# EAGLE design Justin Ngo_u0453732_MotorPCB_Rev3 (EAGLE 7.7.0)
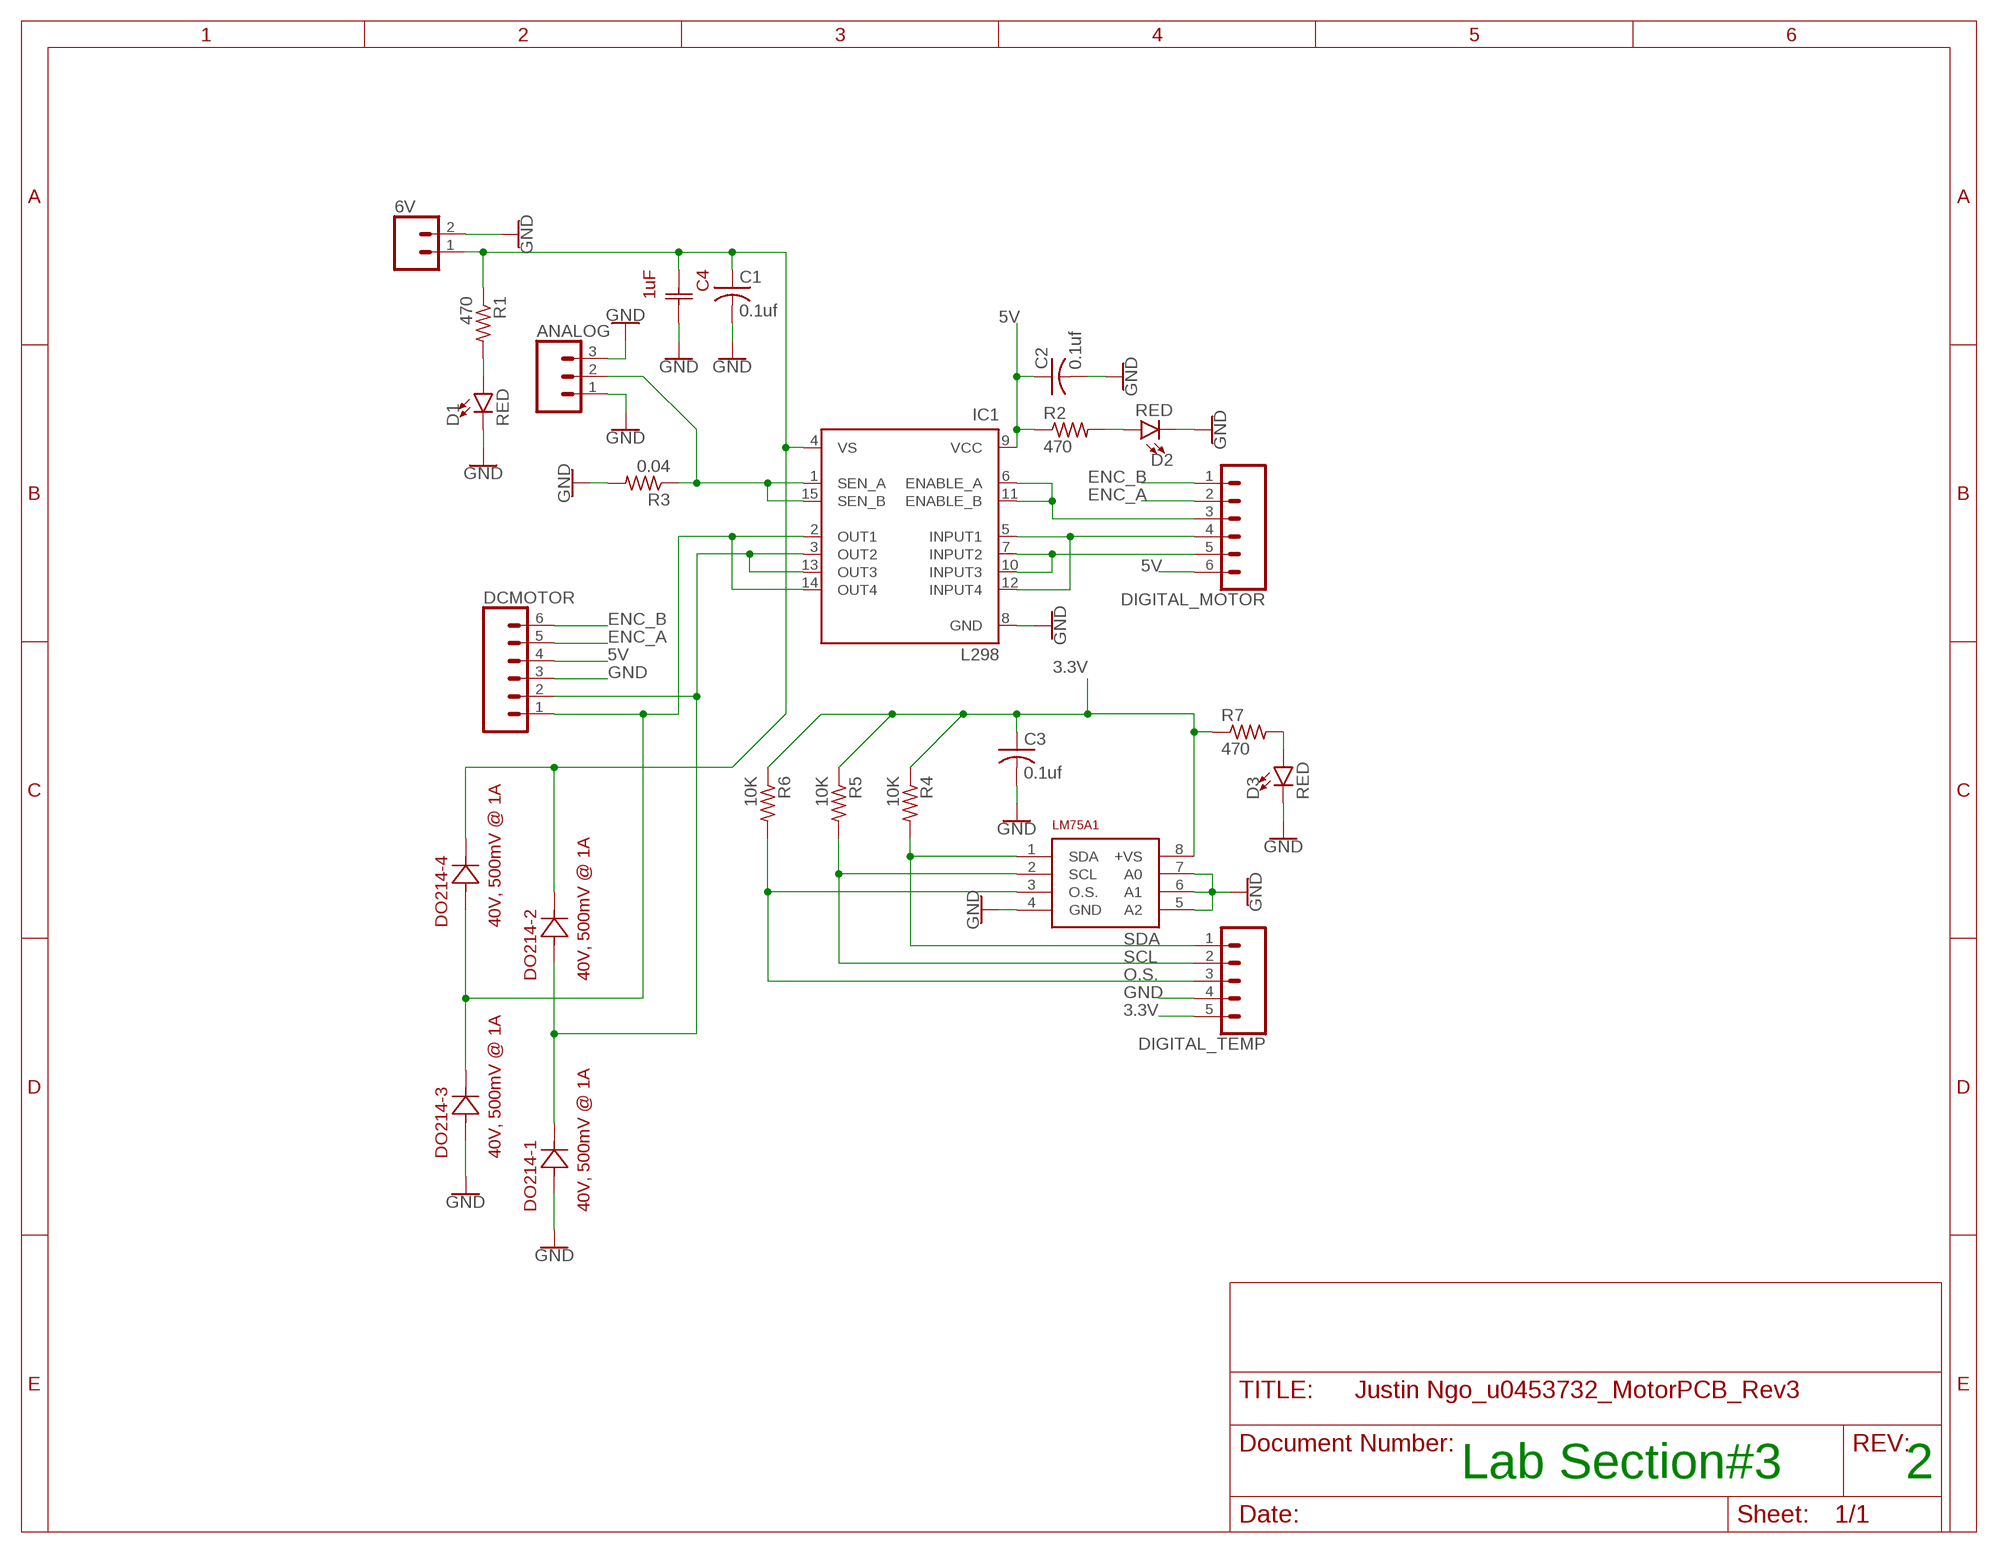
[diagram p0: schematic, sheet 1]

## Parts
6V  CONN_025MM  [SCREWTERMINAL-5MM-2]
ANALOG  CONN_03  [1X03]
C1  0.1uf  C-USC1206  [C1206]
C2  0.1uf  C-USC1206  [C1206]
C3  0.1uf  C-USC1206  [C1206]
C4  1uF  UVK1H010MDD1TD  [U1-E]
D1  RED  LED-RED1206  [LED-1206]
D2  RED  LED-RED1206  [LED-1206]
D3  RED  LED-RED1206  [LED-1206]
DCMOTOR  CONN_06LOCK_LONGPADS  [1X06_LOCK_LONGPADS]
DIGITAL_MOTOR  CONN_06LOCK_LONGPADS  [1X06_LOCK_LONGPADS]
DIGITAL_TEMP  CONN_05LOCK_LONGPADS  [1X05_LOCK_LONGPADS]
DO214-1  40V, 500mV @ 1A  SS14  [DIODE_DO214AC]
DO214-2  40V, 500mV @ 1A  SS14  [DIODE_DO214AC]
DO214-3  40V, 500mV @ 1A  SS14  [DIODE_DO214AC]
DO214-4  40V, 500mV @ 1A  SS14  [DIODE_DO214AC]
IC1  L298  [MULTIWATT-15]
LM75A1  TI-LM75A  [TI-LM75A]
R1  470  R-US_R1206  [R1206]
R2  470  R-US_R1206  [R1206]
R3  0.04  R-US_R1206  [R1206]
R4  10K  R-US_R1206  [R1206]
R5  10K  R-US_R1206  [R1206]
R6  10K  R-US_R1206  [R1206]
R7  470  R-US_R1206  [R1206]

## Nets
3.3V: C3.1 DIGITAL_TEMP.5 LM75A1.8(+VS) R4.1 R5.1 R6.1 R7.1
5V: C2.1 DCMOTOR.4 DIGITAL_MOTOR.6 IC1.9(VCC) R2.1
ANALOG: ANALOG.2 IC1.1(SEN_A) IC1.15(SEN_B) R3.1
ENC_A: DCMOTOR.5 DIGITAL_MOTOR.2
ENC_B: DCMOTOR.6 DIGITAL_MOTOR.1
GND: 6V.2 ANALOG.1 ANALOG.3 C1.2 C2.2 C3.2 C4.2 D1.C D2.C D3.C DCMOTOR.3 DIGITAL_TEMP.4 DO214-1.2 DO214-3.2 IC1.8(GND) LM75A1.4(GND) LM75A1.5(A2) LM75A1.6(A1) LM75A1.7(A0) R3.2
N$1: D1.A R1.2
N$2: D3.A R7.2
N$4: DIGITAL_MOTOR.3 IC1.6(ENABLE_A) IC1.11(ENABLE_B)
N$6: DIGITAL_MOTOR.5 IC1.7(INPUT2) IC1.10(INPUT3)
N$9: DIGITAL_MOTOR.4 IC1.5(INPUT1) IC1.12(INPUT4)
N$10: DCMOTOR.2 DO214-1.1 DO214-2.2 IC1.3(OUT2) IC1.13(OUT3)
N$12: DCMOTOR.1 DO214-3.1 DO214-4.2 IC1.2(OUT1) IC1.14(OUT4)
N$13: 6V.1 C1.1 C4.1 DO214-2.1 DO214-4.1 IC1.4(VS) R1.1
N$15: D2.A R2.2
O.S.: DIGITAL_TEMP.3 LM75A1.3(O.S.) R6.2
SCL: DIGITAL_TEMP.2 LM75A1.2(SCL) R5.2
SDA: DIGITAL_TEMP.1 LM75A1.1(SDA) R4.2

## Notes on the sheet
- Lab Section#3 | 2

## Library data of the parts
6V = SparkFun-Connectors:CONN_02: Multi connection point. Often used as Generic Header-pin footprint for 0.1 inch spaced/style header connections On any of the 0.1 inch spaced packages, you can populate with these: Break Away Headers - Straight <https://www.sparkfun.com/products/116> (PRT-00116) Break Away Male Headers - Right Angle <https://www.sparkfun.com/products/553> (PRT-00553) Female Headers <https://www.sparkfun.com/products/115> (PRT-00115) Break Away Headers - Machine Pin <https://www.sparkfun.com/products/117> (PRT-00117) Break Away Female Headers - Swiss Machine Pin <https://www.sparkfun.com/products/743> (PRT-00743) For SCREWTERMINALS and SPRING TERMINALS visit here: Screw Terimnals on SparkFun.com <https://www.sparkfun.com/search/results?term=Screw+Terminals> (5mm/3.5mm/2.54mm spacing) This device is also useful as a general connection point to wire up your design to another part of your project. Our various solder wires solder well into these plated through hole pads. Hook-Up Wire - Assortment (Stranded, 22 AWG) <https://www.sparkfun.com/products/11375> (PRT-11375) Hook-Up Wire - Assortment (Solid Core, 22 AWG) <https://www.sparkfun.com/products/11367> (PRT-11367) View the entire wire category on our website here <https://www.sparkfun.com/categories/141> Special notes: Molex polarized connector foot print use with: PRT-08233 with associated crimp pins and housings. 2.54_SCREWTERM for use with PRT-10571. 3.5mm Screw Terminal footprints for PRT-08084 5mm Screw Terminal footprints for use with PRT-08432; SF_SKU: PRT-08432
ANALOG = SparkFun-Connectors:CONN_03: Multi connection point. Often used as Generic Header-pin footprint for 0.1 inch spaced/style header connections On any of the 0.1 inch spaced packages, you can populate with these: Break Away Headers - Straight <https://www.sparkfun.com/products/116> (PRT-00116) Break Away Male Headers - Right Angle <https://www.sparkfun.com/products/553> (PRT-00553) Female Headers <https://www.sparkfun.com/products/115> (PRT-00115) Break Away Headers - Machine Pin <https://www.sparkfun.com/products/117> (PRT-00117) Break Away Female Headers - Swiss Machine Pin <https://www.sparkfun.com/products/743> (PRT-00743) Stackable Header - 3 Pin (Female, 0.1") <https://www.sparkfun.com/products/13875> (PRT-13875) For SCREWTERMINALS and SPRING TERMINALS visit here: Screw Terimnals on SparkFun.com <https://www.sparkfun.com/search/results?term=Screw+Terminals> (5mm/3.5mm/2.54mm spacing) This device is also useful as a general connection point to wire up your design to another part of your project. Our various solder wires solder well into these plated through hole pads. Hook-Up Wire - Assortment (Stranded, 22 AWG) <https://www.sparkfun.com/products/11375> (PRT-11375) Hook-Up Wire - Assortment (Solid Core, 22 AWG) <https://www.sparkfun.com/products/11367> (PRT-11367) View the entire wire category on our website here <https://www.sparkfun.com/categories/141> Special notes: Molex polarized connector foot print use with SKU : PRT-08232 with associated crimp pins and housings.
C1-C3 = rcl:C-US: CAPACITOR, American symbol
C4 = Ngo3:UVK1H010MDD1TD; COPYRIGHT: Copyright C 2015 Accelerated Designs. All rights reserved; MANUFACTURER_PART_NUMBER: UVK1H010MDD1TD; VENDOR: Vendor
D1-D3 = SparkFun-LED:LED-RED: Red SMD LED Used in manufacturing of most products at SparkFun Packages: 0603 - SMD 0603 package [Product Link] <http://docs.avagotech.com/docs/AV02-0551EN> 0603 SMART - SMD 0603 SMART package ( more efficient and expensive)[Product Link] <http://www.osram-os.com/Graphics/XPic2/00077099_0.pdf> 1206 - SMD1206 package [Product Link] <https://www.sparkfun.com/datasheets/DevTools/LilyPad/Q150OVS4.pdff> SparkFun Products: Pro Mini 328 -5V <https://www.sparkfun.com/products/821> RedBoard <https://www.sparkfun.com/products/12757> IOIO-OTG <https://www.sparkfun.com/products/13613>; PROD_ID: DIO-09912
DCMOTOR DIGITAL_MOTOR = SparkFun-Connectors:CONN_06: Multi connection point. Often used as Generic Header-pin footprint for 0.1 inch spaced/style header connections On any of the 0.1 inch spaced packages, you can populate with these: Break Away Headers - Straight <https://www.sparkfun.com/products/116> (PRT-00116) Break Away Male Headers - Right Angle <https://www.sparkfun.com/products/553> (PRT-00553) Female Headers <https://www.sparkfun.com/products/115> (PRT-00115) Break Away Headers - Machine Pin <https://www.sparkfun.com/products/117> (PRT-00117) Break Away Female Headers - Swiss Machine Pin <https://www.sparkfun.com/products/743> (PRT-00743) Arduino Stackable Header - 6 Pin <https://www.sparkfun.com/products/9280> (PRT-09280) For SCREWTERMINALS and SPRING TERMINALS visit here: Screw Terimnals on SparkFun.com <https://www.sparkfun.com/search/results?term=Screw+Terminals> (5mm/3.5mm/2.54mm spacing) This device is also useful as a general connection point to wire up your design to another part of your project. Our various solder wires solder well into these plated through hole pads. Hook-Up Wire - Assortment (Stranded, 22 AWG) <https://www.sparkfun.com/products/11375> (PRT-11375) Hook-Up Wire - Assortment (Solid Core, 22 AWG) <https://www.sparkfun.com/products/11367> (PRT-11367) View the entire wire category on our website here <https://www.sparkfun.com/categories/141>
DIGITAL_TEMP = SparkFun-Connectors:CONN_05: Multi connection point. Often used as Generic Header-pin footprint for 0.1 inch spaced/style header connections On any of the 0.1 inch spaced packages, you can populate with these: Break Away Headers - Straight <https://www.sparkfun.com/products/116> (PRT-00116) Break Away Male Headers - Right Angle <https://www.sparkfun.com/products/553> (PRT-00553) Female Headers <https://www.sparkfun.com/products/115> (PRT-00115) Break Away Headers - Machine Pin <https://www.sparkfun.com/products/117> (PRT-00117) Break Away Female Headers - Swiss Machine Pin <https://www.sparkfun.com/products/743> (PRT-00743) For SCREWTERMINALS and SPRING TERMINALS visit here: Screw Terimnals on SparkFun.com <https://www.sparkfun.com/search/results?term=Screw+Terminals> (5mm/3.5mm/2.54mm spacing) This device is also useful as a general connection point to wire up your design to another part of your project. Our various solder wires solder well into these plated through hole pads. Hook-Up Wire - Assortment (Stranded, 22 AWG) <https://www.sparkfun.com/products/11375> (PRT-11375) Hook-Up Wire - Assortment (Solid Core, 22 AWG) <https://www.sparkfun.com/products/11367> (PRT-11367) View the entire wire category on our website here <https://www.sparkfun.com/categories/141> Special notes: Molex polarized connector foot print use with SKU : PRT-08231 with associated crimp pins and housings. 1MM SMD Version SKU: PRT-10208
DO214-1-DO214-4 = Ngo2:SS14; COPYRIGHT: Copyright C 2015 Accelerated Designs. All rights reserved; DESCRIPTION: Schottky barrier diodeSS14 1A 40V; FAMILY: Rectifier; MANUFACTURER_NAME: Vishay; MANUFACTURER_PART_NUMBER: SS14; RSPARTNUMBER: 4470352; SECTION: Discretes; SUPERSECTION: Semiconductors; VENDOR: Vishay
IC1 = st-microelectronics:L298: DUAL FULL-BRIDGE DRIVER; MPN: L298N; OC_FARNELL: 1589425; OC_NEWARK: 32M1527
LM75A1 = Ngo:TI-LM75A
R1-R7 = rcl:R-US_: RESISTOR, American symbol

## Board
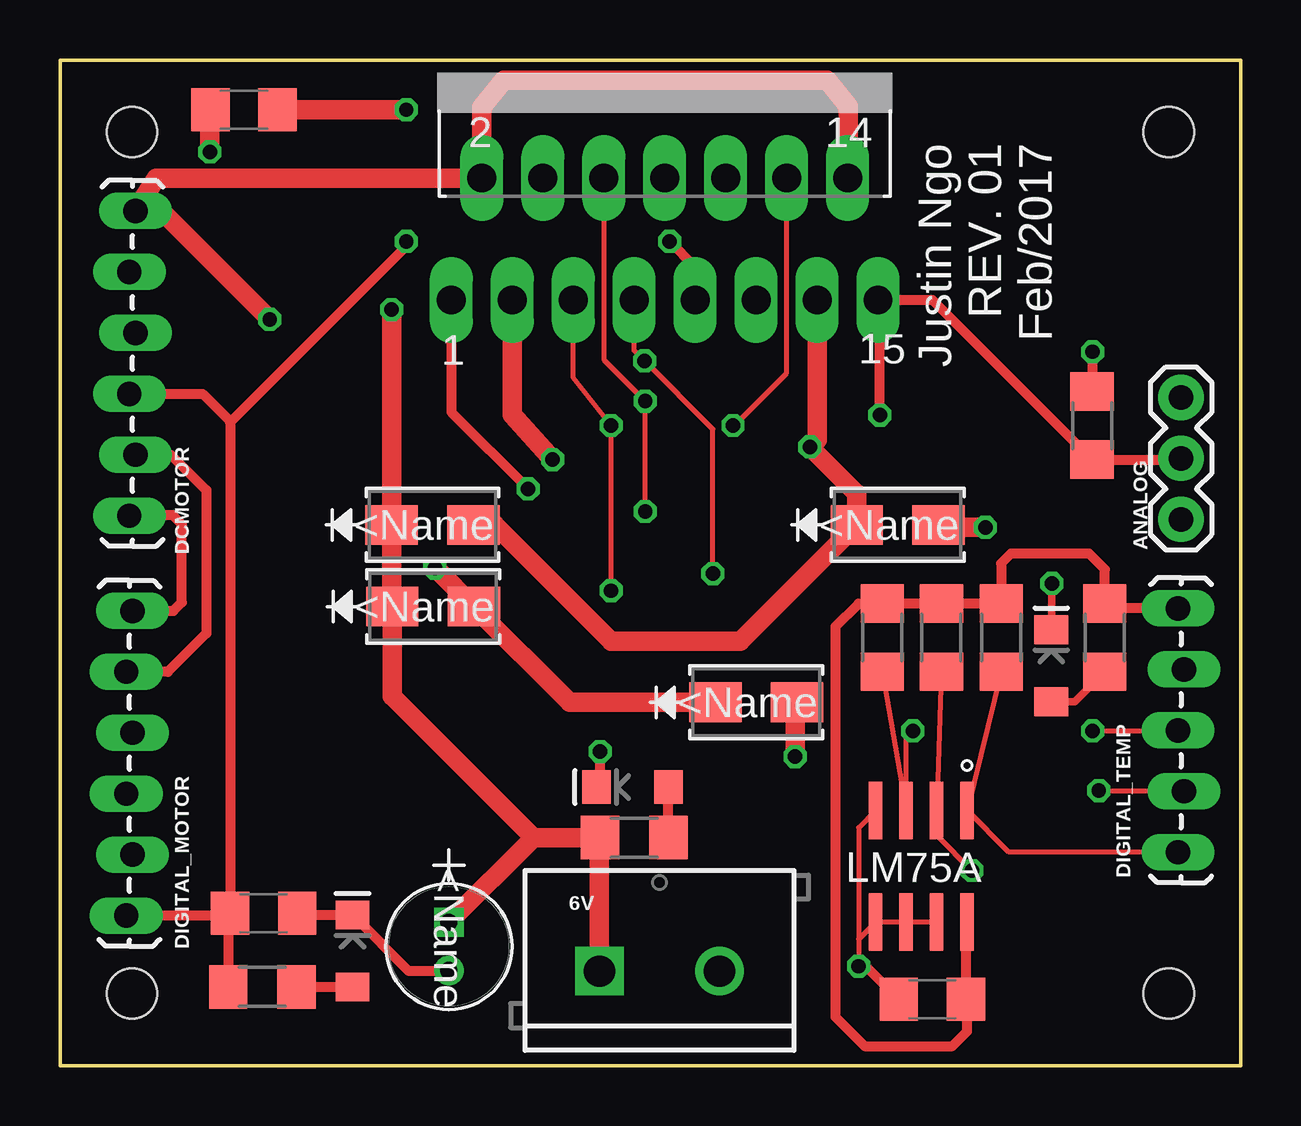
[diagram p1: board, top side]
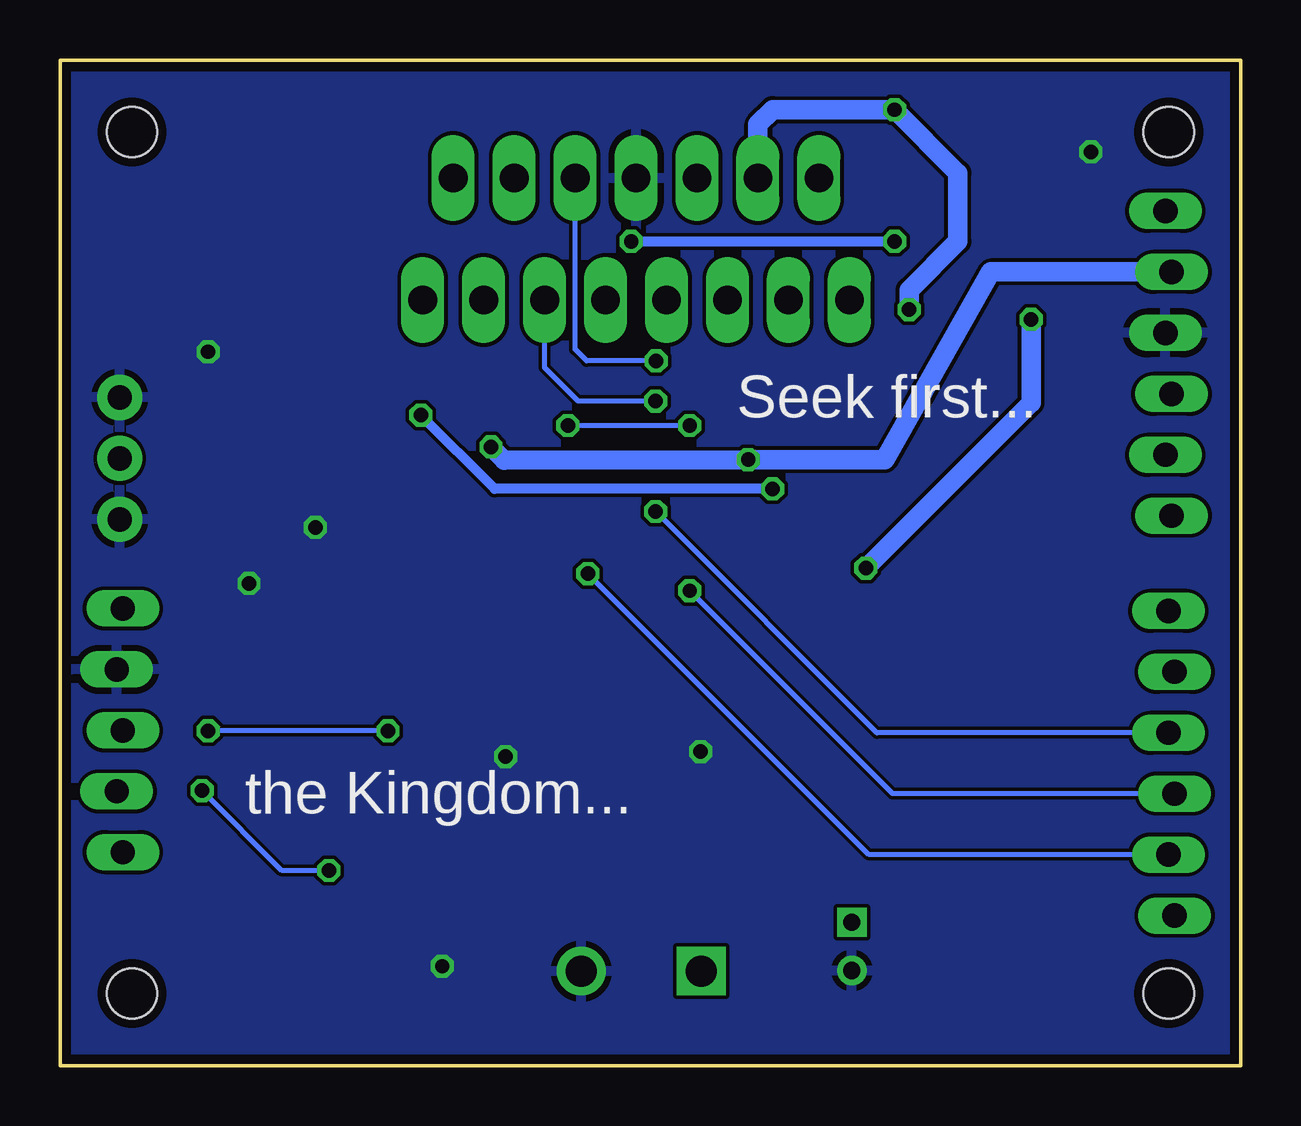
[diagram p2: board, bottom side, seen from below]

Size 49.2 x 41.9 mm. Coordinates in mm from the lower left corner, seen from the top.
Outline: 0,0 49.2,0 49.2,41.9 0,41.9 0,0
Copper layers (1*16): Top 0.0356mm / dielectric 1.5011mm / Bottom 0.0356mm
Design rules "oshpark-2layer": minimum track width 6mil, minimum drill 13mil, track to track 6mil, track to pad 6mil, pad to pad 6mil, via to via 6mil, smd to smd 6mil, copper to edge 15mil, drill to drill 6mil, minimum pad ring 7mil, minimum via ring 7mil, stop-mask expansion 2.5mil, vias tented up to drill 0mil, thermal gap 10mil
Holes 2.1 mm at 3,38.9 46.2,38.9 3,3 46.2,3

### Footprints (pad centres in the part's own frame; a part is rotated, then mirrored left to right if it is on the bottom)
SCREWTERMINAL-5MM-2 = drill 1.3 pad 2.032 square: 1 0,0 | drill 1.3 pad 2.032: 2 5,0
1X03 = drill 1.016 pad 1.88: 1 0,0; 2 2.54,0; 3 5.08,0
C1206 = smd 1.6 x 1.8: 1 -1.4,0; 2 1.4,0
U1-E = drill 0.711 pad 1.219 square: 1 -2.007,0 | drill 0.711 pad 1.219: 2 0,0
LED-1206 = smd 1.2 x 1.4: A -1.5,0; C 1.5,0
1X06_LOCK_LONGPADS = drill 1.016 long: 1 0,0; 2 2.54,-0.254; 3 5.08,0; 4 7.62,-0.254; 5 10.16,0; 6 12.7,-0.254
1X05_LOCK_LONGPADS = drill 1.016 long: 1 0,0; 2 2.54,-0.254; 3 5.08,0; 4 7.62,-0.254; 5 10.16,0
DIODE_DO214AC = smd 2.184 x 1.651: 1 -1.702,0; 2 1.702,0
MULTIWATT-15 = drill 1.2 long: 1 -8.89,-7.62; 2 -7.62,-2.54; 3 -6.35,-7.62; 4 -5.08,-2.54; 5 -3.81,-7.62; 6 -2.54,-2.54; 7 -1.27,-7.62; 8 0,-2.54; 9 1.27,-7.62; 10 2.54,-2.54; 11 3.81,-7.62; 12 5.08,-2.54; 13 6.35,-7.62; 14 7.62,-2.54; 15 8.89,-7.62
TI-LM75A = smd 0.559 x 2.388: 1 0,-2.324; 2 1.27,-2.324; 3 2.54,-2.324; 4 3.81,-2.324; 5 3.81,2.324; 6 2.54,2.324; 7 1.27,2.324; 8 0,2.324
R1206 = smd 1.6 x 1.803: 1 -1.422,0; 2 1.422,0

### Placement (x,y rotation side)
6V  22.48,3.94 0 top
ANALOG  46.71,22.76 90 top
C1  7.67,39.83 180 top
C2  8.48,6.35 0 top
C3  36.35,2.77 180 top
C4  16.21,3.96 270 top
D1  23.85,11.61 180 top
D2  12.19,4.78 90 top
D3  41.3,16.66 90 top
DCMOTOR  3.14,35.61 270 top
DIGITAL_MOTOR  3.01,18.95 270 top
DIGITAL_TEMP  46.58,8.89 90 top
DO214-1  34.9,22.53 0 top
DO214-2  15.52,22.53 0 top
DO214-3  29.01,15.14 0 top
DO214-4  15.54,19.13 0 top
IC1  25.2,39.52 0 top
LM75A1  37.8,8.31 180 top
R1  23.93,9.5 0 top
R2  8.43,3.28 0 top
R3  43,26.67 90 top
R4  39.22,17.83 270 top
R5  36.73,17.83 270 top
R6  34.26,17.83 270 top
R7  43.54,17.83 270 top

### Tracks (layer width: path | path; a pad name or v marks a point on that pad's centre or on a via)
3.3V
  Top 0.203: 37.8,2.82 C3.1
  Top 0.254: LM75A1.8 37.75,5.93
  Top 0.305: 37.8,2.72 C3.1
  Top 0.406: DIGITAL_TEMP.5 43.74,19.05 R7.1 43.54,20.68 42.88,21.34 39.62,21.34 39.22,20.93 R4.1 R5.1 R6.1 33.27,19.25 32.31,18.29 32.31,2.03 33.53,0.81 37.19,0.81 37.8,1.42 37.8,2.72 | 37.75,5.93 C3.1
5V  (via drill 0.6 pad 0.41)
  Top 0.305: 7.01,6.27 C2.1
  Top 0.406: DCMOTOR.4 5.94,27.99 7.11,26.82 | 7.11,26.82 7.08,26.79 C2.1 | R2.1 7.01,6.27 6.98,6.25 DIGITAL_MOTOR.6 | IC1.9 26.47,33.27 v25.4,34.34 | v14.43,34.34 14.43,34.14 7.11,26.82
  Bottom 0.406: v25.4,34.34 v14.43,34.34
ANALOG  (via drill 0.6 pad 0.41)
  Top 0.203: 46.66,25.25 ANALOG.2 | 34.14,31.85 IC1.15 34.16,31.83
  Top 0.406: IC1.15 36.35,31.9 R3.1 46.66,25.25 | IC1.1 16.31,27.23 v19.51,24.03 | v34.16,27.1 34.16,31.83
  Bottom 0.406: v19.51,24.03 31.09,24.03 v34.16,27.1
ENC_A
  Top 0.406: DCMOTOR.5 4.62,25.45 6.1,23.98 6.1,18.01 4.5,16.41 DIGITAL_MOTOR.2
ENC_B
  Top 0.406: DIGITAL_MOTOR.1 4.72,18.95 5.08,19.3 5.08,22.55 4.7,22.94 2.41,22.94 DCMOTOR.6
GND  (via drill 0.6 pad 0.41)
  Top 0.203: R3.2 43.03,28.12 | LM75A1.7 LM75A1.6 LM75A1.5 33.27,5.27 v33.27,4.14 33.27,9.92 LM75A1.4
  Top 0.254: D1.C 22.5,11.76
  Top 0.305: C2.2 9.96,6.28 | D3.C 41.33,18.19 v41.33,20.09
  Top 0.406: 22.5,11.76 v22.5,13.08 | 43.03,28.12 v43.03,29.74 | 9.96,6.28 D2.C 14.51,3.96 C4.2 | C3.2 33.58,4.14 v33.27,4.14
  Top 0.813: C1.2 6.25,39.8 v6.25,38.08 | DO214-3.2 30.63,15.06 v30.63,12.88 | DO214-1.2 36.7,22.43 v38.56,22.43
  pour Bottom: -1.63,43.28 51.61,43.28 52.02,43.28 52.02,-2.84 -1.63,-2.84
N$1
  Top 0.305: D1.A
  Top 0.406: R1.2 D1.A
N$2
  Top 0.305: R7.2 42.29,15.16 D3.A
N$4  (via drill 0.6 pad 0.41)
  Top 0.203: IC1.6 22.66,29.41 v24.38,27.69 v24.38,23.09
  Bottom 0.203: v24.38,27.69 27.61,27.69 29.01,29.08 IC1.11 | DIGITAL_MOTOR.3 15.16,13.87 v24.38,23.09
N$6  (via drill 0.6 pad 0.41)
  Top 0.203: IC1.7 23.93,29.79 v24.36,29.36 27.2,26.52 v27.2,20.5
  Bottom 0.203: v24.36,29.36 27.25,29.36 27.74,29.84 IC1.10 | DIGITAL_MOTOR.5 15.49,8.79 v27.2,20.5
N$9  (via drill 0.6 pad 0.41)
  Top 0.203: IC1.5 21.39,28.65 v22.96,26.67 v22.96,19.79 | v28.04,26.67 28.09,26.67 30.28,28.85 IC1.12
  Bottom 0.203: v22.96,26.67 v28.04,26.67 | DIGITAL_MOTOR.4 14.5,11.33 v22.96,19.79
N$10  (via drill 0.6 pad 0.41)
  Top 0.813: v20.52,25.25 18.85,27.13 IC1.3 | IC1.13 31.55,26.09 v31.24,25.78 33.2,23.82 DO214-1.1 28.35,17.68 22.96,17.68 18.11,22.53 DO214-2.2
  Bottom 0.813: v31.24,25.78 30.68,25.22 v20.52,25.25 14.83,25.25 10.41,33.07 DCMOTOR.2
N$12  (via drill 0.6 pad 0.41)
  Top 0.813: IC1.14 32.84,37.01 32.84,39.98 31.98,41.05 18.49,41.05 17.58,39.93 IC1.2 4.01,36.98 DCMOTOR.1 4.22,35.61 v8.74,31.09 | DO214-3.1 21.23,15.14 DO214-4.2 15.65,20.73 v15.62,20.73
  Bottom 0.813: v15.62,20.73 8.74,27.61 v8.74,31.09
N$13  (via drill 0.6 pad 0.41)
  Top 0.813: v14.43,39.83 C1.1 | 6V.1 22.48,9.47 R1.1 19.74,9.5 | 19.74,9.5 C4.1 | v13.82,31.5 DO214-2.1 13.82,19.15 DO214-4.1 13.84,15.39 19.74,9.5
  Bottom 0.813: IC1.4 20.12,39.22 19.51,39.83 v14.43,39.83 11.79,37.19 11.79,34.34 13.82,32.31 v13.82,31.5
N$15
  Top 0.305: D2.A
  Top 0.406: R2.2 D2.A
O.S.  (via drill 0.6 pad 0.41)
  Top 0.203: R6.2 LM75A1.3 35.26,13.66 v35.53,13.95 | v43.03,13.95 46.56,13.95 DIGITAL_TEMP.3
  Bottom 0.203: v35.53,13.95 v43.03,13.95
SCL  (via drill 0.6 pad 0.41)
  Top 0.203: R5.2 LM75A1.2 36.52,9.6 v38,8.13 | v43.28,11.46 46.81,11.46 DIGITAL_TEMP.2
  Bottom 0.203: v38,8.13 39.95,8.13 v43.28,11.46
SDA
  Top 0.203: DIGITAL_TEMP.1 39.53,8.89 LM75A1.1 R4.2

### Text on the board
tPlace: Justin Ngo / REV. 01 / Feb/2017
bPlace: Seek first... | the Kingdom...